# Altium schematic sheet 最小系统板.SchDoc
size A3
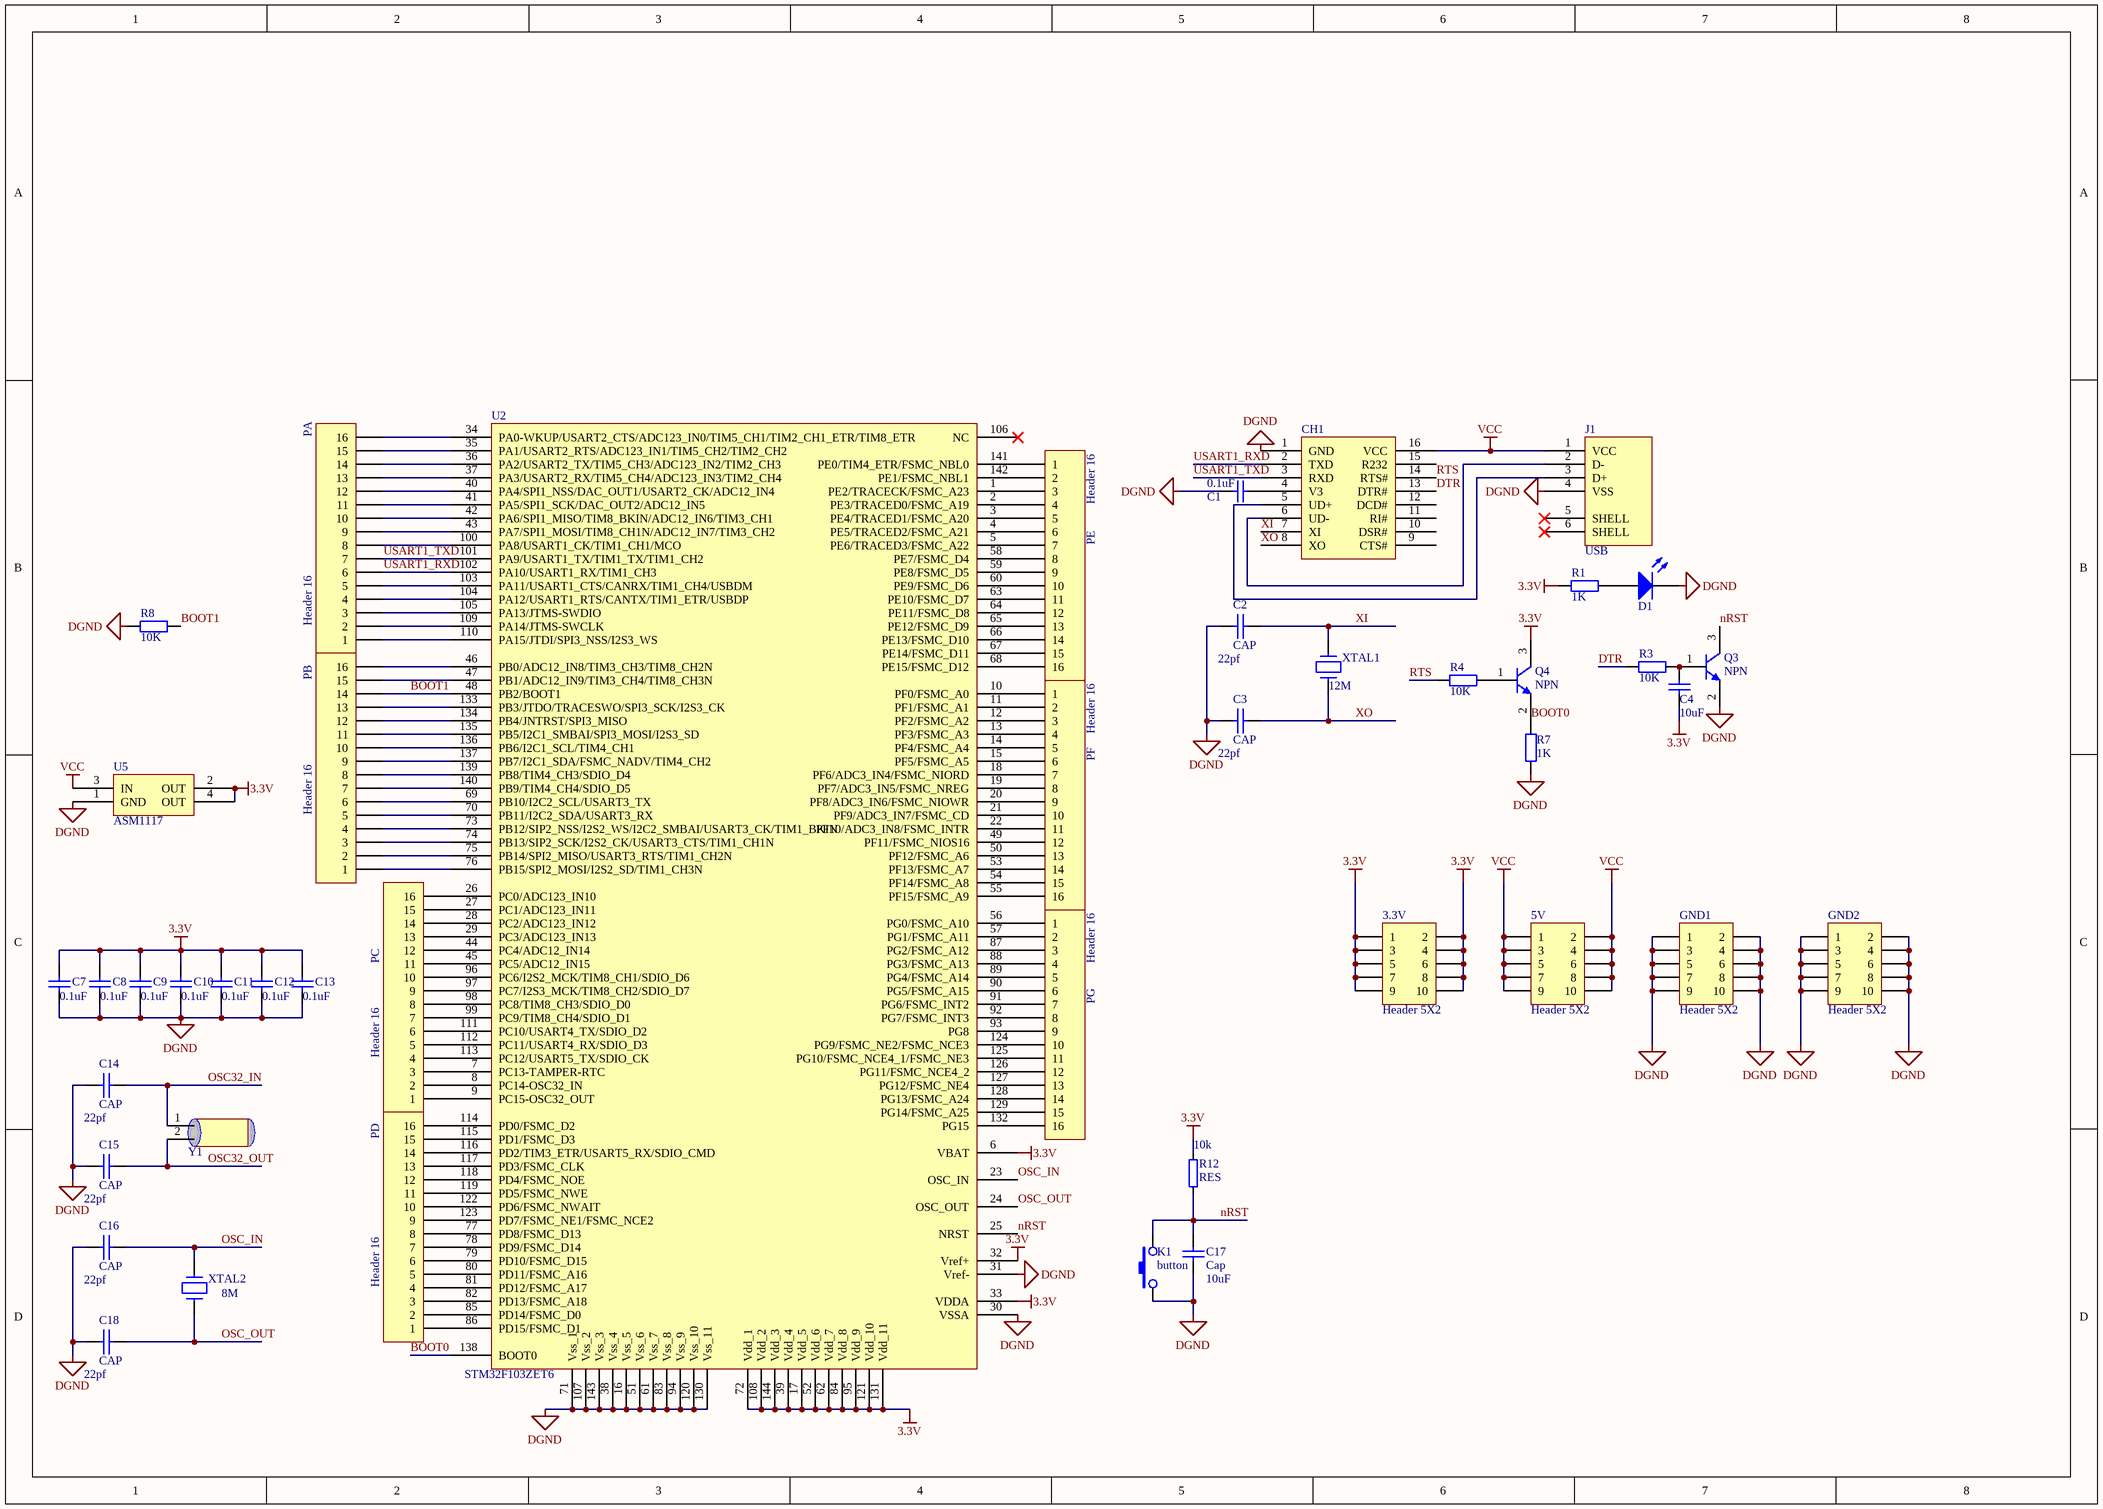
[diagram p0: 最小系统板.SchDoc]

## Parts
3.3V  Header 5X2  [HDR2X5]
5V  Header 5X2  [HDR2X5]
C1  value 0.1uF  [0805]  (hidden comment: Cap)
C2  CAP  value 22pf  [0805]
C3  CAP  value 22pf  [0805]
C4  value 10uF  [1206]  (hidden comment: Cap)
C7  value 0.1uF  [0805]  (hidden comment: Cap)
C8  value 0.1uF  [0805]  (hidden comment: Cap)
C9  value 0.1uF  [0805]  (hidden comment: Cap)
C10  value 0.1uF  [0805]  (hidden comment: Cap)
C11  value 0.1uF  [0805]  (hidden comment: Cap)
C12  value 0.1uF  [0805]  (hidden comment: Cap)
C13  value 0.1uF  [0805]  (hidden comment: Cap)
C14  CAP  value 22pf  [0805]
C15  CAP  value 22pf  [0805]
C16  CAP  value 22pf  [0805]
C17  Cap  value 10uF  [1206]
C18  CAP  value 22pf  [0805]
CH1  Component_1  [SOIC127P600X170-16N]  (value not drawn)
D1  LED0  [LED-0805]  (value not drawn)
GND1  Header 5X2  [HDR2X5]
GND2  Header 5X2  [HDR2X5]
J1  USB  [USB_B1]
K1  button  [SW_PB4_A1]
PA  Header 16  [HDR1X16]
PB  Header 16  [HDR1X16]
PC  Header 16  [HDR1X16]
PD  Header 16  [HDR1X16]
PE  Header 16  [HDR1X16]
PF  Header 16  [HDR1X16]
PG  Header 16  [HDR1X16]
Q3  NPN  [SOT23-3]
Q4  NPN  [SOT23-3]
R1  value 1K  [0805]  (hidden comment: Res2)
R3  value 10K  [0805]  (hidden comment: Res2)
R4  value 10K  [0805]  (hidden comment: Res2)
R7  value 1K  [0805]  (hidden comment: Res2)
R8  value 10K  [0805]  (hidden comment: Res2)
R12  RES  value 10k  [0805]
U2  STM32F103ZET6  [TQFP-144]
U5  ASM1117  [SOT223]
XTAL1  value 12M  [X-SM49]  (hidden comment: CRYSTAL)
XTAL2  value 8M  [X-SM49]  (hidden comment: CRYSTAL)
Y1  32K晶振  [X-TC15]  (value not drawn)

## Nets
3.3V: 3.3V.1 3.3V.2 3.3V.3 3.3V.4 3.3V.5 3.3V.6 3.3V.7 3.3V.8 3.3V.9 3.3V.10 C4.1 C7.2 C8.2 C9.2 C10.2 C11.2 C12.2 C13.2 Q4.3(C) R1.1 R12.2 U2.6(VBAT) U2.17(Vdd_5) U2.32(Vref+) U2.33(VDDA) U2.39(Vdd_4) U2.52(Vdd_6) U2.62(Vdd_7) U2.72(Vdd_1) U2.84(Vdd_8) U2.95(Vdd_9) U2.108(Vdd_2) U2.121(Vdd_10) U2.131(Vdd_11) U2.144(Vdd_3) U5.2(OUT) U5.4(OUT)
DGND: C1.2 C2.1 C3.1 C7.1 C8.1 C9.1 C10.1 C11.1 C12.1 C13.1 C14.1 C15.1 C16.1 C17.1 C18.1 CH1.1(GND) D1.2(K) GND1.1 GND1.2 GND1.3 GND1.4 GND1.5 GND1.6 GND1.7 GND1.8 GND1.9 GND1.10 GND2.1 GND2.2 GND2.3 GND2.4 GND2.5 GND2.6 GND2.7 GND2.8 GND2.9 GND2.10 J1.4(VSS) K1.1 Q3.2(E) R7.1 R8.1 U2.16(Vss_5) U2.30(VSSA) U2.31(Vref-) U2.38(Vss_4) U2.51(Vss_6) U2.61(Vss_7) U2.71(Vss_1) U2.83(Vss_8) U2.94(Vss_9) U2.107(Vss_2) U2.120(Vss_10) U2.130(Vss_11) U2.143(Vss_3) U5.1(GND)
VCC: 5V.1 5V.2 5V.3 5V.4 5V.5 5V.6 5V.7 5V.8 5V.9 5V.10 CH1.16(VCC) J1.1(VCC) U5.3(IN)
BOOT0: Q4.2(E) R7.2 U2.138(BOOT0)
BOOT1: PB.14 R8.2 U2.48(PB2/BOOT1)
DTR: CH1.13(DTR#) R3.2
nRST: C17.2 K1.2 Q3.3(C) R12.1 U2.25(NRST)
OSC32_IN: C14.2 Y1.1(X1)
OSC32_OUT: C15.2 Y1.2(X2)
OSC_IN: C16.2 U2.23(OSC_IN) XTAL2.2
OSC_OUT: C18.2 U2.24(OSC_OUT) XTAL2.1
RTS: CH1.14(RTS#) R4.2
USART1_RXD: CH1.2(TXD) PA.6 U2.102(PA10/USART1_RX/TIM1_CH3)
USART1_TXD: CH1.3(RXD) PA.7 U2.101(PA9/USART1_TX/TIM1_TX/TIM1_CH2)
XI: C2.2 CH1.7(XI) XTAL1.2
XO: C3.2 CH1.8(XO) XTAL1.1
NetC1_1: C1.1 CH1.4(V3)
NetC4_2: C4.2 Q3.1(B) R3.1
NetCH1_5: CH1.5(UD+) J1.3(D+)
NetCH1_6: CH1.6(UD-) J1.2(D-)
NetD1_1: D1.1(A) R1.2
NetPA_1: PA.1 U2.110(PA15/JTDI/SPI3_NSS/I2S3_WS)
NetPA_2: PA.2 U2.109(PA14/JTMS-SWCLK)
NetPA_3: PA.3 U2.105(PA13/JTMS-SWDIO)
NetPA_4: PA.4 U2.104(PA12/USART1_RTS/CANTX/TIM1_ETR/USBDP)
NetPA_5: PA.5 U2.103(PA11/USART1_CTS/CANRX/TIM1_CH4/USBDM)
NetPA_8: PA.8 U2.100(PA8/USART1_CK/TIM1_CH1/MCO)
NetPA_9: PA.9 U2.43(PA7/SPI1_MOSI/TIM8_CH1N/ADC12_IN7/TIM3_CH2)
NetPA_10: PA.10 U2.42(PA6/SPI1_MISO/TIM8_BKIN/ADC12_IN6/TIM3_CH1)
NetPA_11: PA.11 U2.41(PA5/SPI1_SCK/DAC_OUT2/ADC12_IN5)
NetPA_12: PA.12 U2.40(PA4/SPI1_NSS/DAC_OUT1/USART2_CK/ADC12_IN4)
NetPA_13: PA.13 U2.37(PA3/USART2_RX/TIM5_CH4/ADC123_IN3/TIM2_CH4)
NetPA_14: PA.14 U2.36(PA2/USART2_TX/TIM5_CH3/ADC123_IN2/TIM2_CH3)
NetPA_15: PA.15 U2.35(PA1/USART2_RTS/ADC123_IN1/TIM5_CH2/TIM2_CH2)
NetPA_16: PA.16 U2.34(PA0-WKUP/USART2_CTS/ADC123_IN0/TIM5_CH1/TIM2_CH1_ETR/TIM8_ETR)
NetPB_1: PB.1 U2.76(PB15/SPI2_MOSI/I2S2_SD/TIM1_CH3N)
NetPB_2: PB.2 U2.75(PB14/SPI2_MISO/USART3_RTS/TIM1_CH2N)
NetPB_3: PB.3 U2.74(PB13/SIP2_SCK/I2S2_CK/USART3_CTS/TIM1_CH1N)
NetPB_4: PB.4 U2.73(PB12/SIP2_NSS/I2S2_WS/I2C2_SMBAI/USART3_CK/TIM1_BKIN)
NetPB_5: PB.5 U2.70(PB11/I2C2_SDA/USART3_RX)
NetPB_6: PB.6 U2.69(PB10/I2C2_SCL/USART3_TX)
NetPB_7: PB.7 U2.140(PB9/TIM4_CH4/SDIO_D5)
NetPB_8: PB.8 U2.139(PB8/TIM4_CH3/SDIO_D4)
NetPB_9: PB.9 U2.137(PB7/I2C1_SDA/FSMC_NADV/TIM4_CH2)
NetPB_10: PB.10 U2.136(PB6/I2C1_SCL/TIM4_CH1)
NetPB_11: PB.11 U2.135(PB5/I2C1_SMBAI/SPI3_MOSI/I2S3_SD)
NetPB_12: PB.12 U2.134(PB4/JNTRST/SPI3_MISO)
NetPB_13: PB.13 U2.133(PB3/JTDO/TRACESWO/SPI3_SCK/I2S3_CK)
NetPB_15: PB.15 U2.47(PB1/ADC12_IN9/TIM3_CH4/TIM8_CH3N)
NetPB_16: PB.16 U2.46(PB0/ADC12_IN8/TIM3_CH3/TIM8_CH2N)
NetPC_1: PC.1 U2.9(PC15-OSC32_OUT)
NetPC_2: PC.2 U2.8(PC14-OSC32_IN)
NetPC_3: PC.3 U2.7(PC13-TAMPER-RTC)
NetPC_4: PC.4 U2.113(PC12/USART5_TX/SDIO_CK)
NetPC_5: PC.5 U2.112(PC11/USART4_RX/SDIO_D3)
NetPC_6: PC.6 U2.111(PC10/USART4_TX/SDIO_D2)
NetPC_7: PC.7 U2.99(PC9/TIM8_CH4/SDIO_D1)
NetPC_8: PC.8 U2.98(PC8/TIM8_CH3/SDIO_D0)
NetPC_9: PC.9 U2.97(PC7/I2S3_MCK/TIM8_CH2/SDIO_D7)
NetPC_10: PC.10 U2.96(PC6/I2S2_MCK/TIM8_CH1/SDIO_D6)
NetPC_11: PC.11 U2.45(PC5/ADC12_IN15)
NetPC_12: PC.12 U2.44(PC4/ADC12_IN14)
NetPC_13: PC.13 U2.29(PC3/ADC123_IN13)
NetPC_14: PC.14 U2.28(PC2/ADC123_IN12)
NetPC_15: PC.15 U2.27(PC1/ADC123_IN11)
NetPC_16: PC.16 U2.26(PC0/ADC123_IN10)
NetPD_1: PD.1 U2.86(PD15/FSMC_D1)
NetPD_2: PD.2 U2.85(PD14/FSMC_D0)
NetPD_3: PD.3 U2.82(PD13/FSMC_A18)
NetPD_4: PD.4 U2.81(PD12/FSMC_A17)
NetPD_5: PD.5 U2.80(PD11/FSMC_A16)
NetPD_6: PD.6 U2.79(PD10/FSMC_D15)
NetPD_7: PD.7 U2.78(PD9/FSMC_D14)
NetPD_8: PD.8 U2.77(PD8/FSMC_D13)
NetPD_9: PD.9 U2.123(PD7/FSMC_NE1/FSMC_NCE2)
NetPD_10: PD.10 U2.122(PD6/FSMC_NWAIT)
NetPD_11: PD.11 U2.119(PD5/FSMC_NWE)
NetPD_12: PD.12 U2.118(PD4/FSMC_NOE)
NetPD_13: PD.13 U2.117(PD3/FSMC_CLK)
NetPD_14: PD.14 U2.116(PD2/TIM3_ETR/USART5_RX/SDIO_CMD)
NetPD_15: PD.15 U2.115(PD1/FSMC_D3)
NetPD_16: PD.16 U2.114(PD0/FSMC_D2)
NetPE_1: PE.1 U2.141(PE0/TIM4_ETR/FSMC_NBL0)
NetPE_2: PE.2 U2.142(PE1/FSMC_NBL1)
NetPE_3: PE.3 U2.1(PE2/TRACECK/FSMC_A23)
NetPE_4: PE.4 U2.2(PE3/TRACED0/FSMC_A19)
NetPE_5: PE.5 U2.3(PE4/TRACED1/FSMC_A20)
NetPE_6: PE.6 U2.4(PE5/TRACED2/FSMC_A21)
NetPE_7: PE.7 U2.5(PE6/TRACED3/FSMC_A22)
NetPE_8: PE.8 U2.58(PE7/FSMC_D4)
NetPE_9: PE.9 U2.59(PE8/FSMC_D5)
NetPE_10: PE.10 U2.60(PE9/FSMC_D6)
NetPE_11: PE.11 U2.63(PE10/FSMC_D7)
NetPE_12: PE.12 U2.64(PE11/FSMC_D8)
NetPE_13: PE.13 U2.65(PE12/FSMC_D9)
NetPE_14: PE.14 U2.66(PE13/FSMC_D10)
NetPE_15: PE.15 U2.67(PE14/FSMC_D11)
NetPE_16: PE.16 U2.68(PE15/FSMC_D12)
NetPF_1: PF.1 U2.10(PF0/FSMC_A0)
NetPF_2: PF.2 U2.11(PF1/FSMC_A1)
NetPF_3: PF.3 U2.12(PF2/FSMC_A2)
NetPF_4: PF.4 U2.13(PF3/FSMC_A3)
NetPF_5: PF.5 U2.14(PF4/FSMC_A4)
NetPF_6: PF.6 U2.15(PF5/FSMC_A5)
NetPF_7: PF.7 U2.18(PF6/ADC3_IN4/FSMC_NIORD)
NetPF_8: PF.8 U2.19(PF7/ADC3_IN5/FSMC_NREG)
NetPF_9: PF.9 U2.20(PF8/ADC3_IN6/FSMC_NIOWR)
NetPF_10: PF.10 U2.21(PF9/ADC3_IN7/FSMC_CD)
NetPF_11: PF.11 U2.22(PF10/ADC3_IN8/FSMC_INTR)
NetPF_12: PF.12 U2.49(PF11/FSMC_NIOS16)
NetPF_13: PF.13 U2.50(PF12/FSMC_A6)
NetPF_14: PF.14 U2.53(PF13/FSMC_A7)
NetPF_15: PF.15 U2.54(PF14/FSMC_A8)
NetPF_16: PF.16 U2.55(PF15/FSMC_A9)
NetPG_1: PG.1 U2.56(PG0/FSMC_A10)
NetPG_2: PG.2 U2.57(PG1/FSMC_A11)
NetPG_3: PG.3 U2.87(PG2/FSMC_A12)
NetPG_4: PG.4 U2.88(PG3/FSMC_A13)
NetPG_5: PG.5 U2.89(PG4/FSMC_A14)
NetPG_6: PG.6 U2.90(PG5/FSMC_A15)
NetPG_7: PG.7 U2.91(PG6/FSMC_INT2)
NetPG_8: PG.8 U2.92(PG7/FSMC_INT3)
NetPG_9: PG.9 U2.93(PG8)
NetPG_10: PG.10 U2.124(PG9/FSMC_NE2/FSMC_NCE3)
NetPG_11: PG.11 U2.125(PG10/FSMC_NCE4_1/FSMC_NE3)
NetPG_12: PG.12 U2.126(PG11/FSMC_NCE4_2)
NetPG_13: PG.13 U2.127(PG12/FSMC_NE4)
NetPG_14: PG.14 U2.128(PG13/FSMC_A24)
NetPG_15: PG.15 U2.129(PG14/FSMC_A25)
NetPG_16: PG.16 U2.132(PG15)
NetQ4_1: Q4.1(B) R4.1

Not connected (* = marked no-connect by the designer): CH1 9(CTS#) 10(DSR#) 11(RI#) 12(DCD#) 15(R232); J1 5(SHELL)* 6(SHELL)*; U2 106(NC)*

## Library data of the parts
3.3V 5V GND1 GND2 = Header 5X2: Header, 5-Pin, Dual row; LatestRevisionDate: 17-Jul-2002; LatestRevisionNote: Re-released for DXP Platform.; Publisher: Altium Limited
C1 C4 C7-C13 C17 = Cap: Capacitor; Published: 8-Jun-2000; LatestRevisionDate: 17-Jul-2002; LatestRevisionNote: Re-released for DXP Platform.; PackageReference: RAD-0.3; Publisher: Altium Limited
  C1 C7-C13: PackageDescription: Radial Cap, Thru-Hole; 2 Leads; 0.3 in Pin Spacing
D1 = LED0: 发光二极管; Published: 8-Jun-2000; LatestRevisionDate: 08-Jul-2005; LatestRevisionNote: Mech Layer 1 removed.; PackageReference: LED-0; Publisher: Altium Limited
J1 = USB: USB接口
PA PB PC PD PE PF PG = Header 16: Header, 16-Pin; LatestRevisionDate: 17-Jul-2002; LatestRevisionNote: Re-released for DXP Platform.; Publisher: Altium Limited
Q3 Q4 = NPN1: 贴片三极管; Published: 8-Jun-2000; LatestRevisionDate: 15-Jan-2003; LatestRevisionNote: PCB Footprint 'BCY-W3/D4.7' replaced; DatasheetDocument: 1997; PackageDocument: Sep-1998; PackageReference: TO-92A; Publisher: Altium Limited; Code_JEDEC: TO-92A; ComponentLink1Description: Manufacturer Link; ComponentLink1URL: http://www.fairchildsemi.com/; ComponentLink2Description: Datasheet; ComponentLink2URL: http://www.fairchildsemi.com/ds/2N%2F2N3904.pdf
R1 R3 R4 R7 R8 = Res2: Resistor; Published: 8-Jun-2000; LatestRevisionDate: 17-Jul-2002; LatestRevisionNote: Re-released for DXP Platform.; PackageReference: AXIAL-0.4; Publisher: Altium Limited; PackageDescription: Axial Device, Thru-Hole; 2 Leads; 0.4 in Pin Spacing
U5 = ASM1117: 3.3V稳压芯片